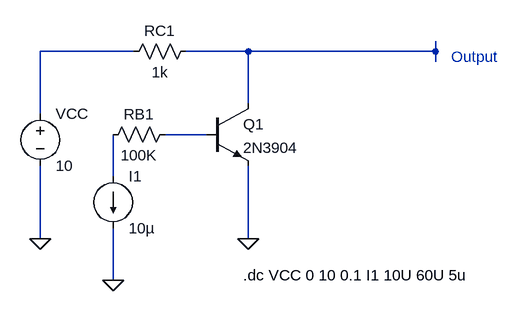
[diagram p0: schematic bjt char.asc]
bjt char.asc, the LTspice schematic file:
Version 4.1
SHEET 1 880 680
WIRE 0 32 -144 32
WIRE 176 32 80 32
WIRE 464 32 464 16
WIRE 464 32 176 32
WIRE 464 48 464 32
WIRE 176 112 176 32
WIRE -144 128 -144 32
WIRE 112 160 48 160
WIRE -32 224 -32 160
WIRE -144 320 -144 208
WIRE 176 320 176 208
WIRE -32 384 -32 304
FLAG 176 320 0
FLAG -32 384 0
FLAG -144 320 0
SYMBOL npn 112 112 R0
SYMATTR InstName Q1
SYMATTR Value 2N3904
SYMBOL res 96 16 R90
WINDOW 0 0 56 VBottom 2
WINDOW 3 32 56 VTop 2
SYMATTR InstName RC1
SYMATTR Value 1k
SYMBOL res 64 144 R90
WINDOW 0 0 56 VBottom 2
WINDOW 3 32 56 VTop 2
SYMATTR InstName RB1
SYMATTR Value 100K
SYMBOL current -32 224 R0
SYMATTR InstName I1
SYMATTR Value 10µ
SYMBOL voltage -144 112 R0
SYMATTR InstName VCC
SYMATTR Value 10
TEXT 488 40 Left 2 ;Output
TEXT 168 376 Left 2 !.dc VCC 0 10 0.1 I1 10U 60U 5u

The netlist it stands for:
* bjt char.asc
Q1 N002 N003 0 0 2N3904
RC1 N002 N001 1k
RB1 N003 N004 100K
I1 N004 0 10µ
VCC N001 0 10
.model NPN NPN
.model PNP PNP
.lib standard.bjt
* Output
.dc VCC 0 10 0.1 I1 10U 60U 5u
.backanno
.end